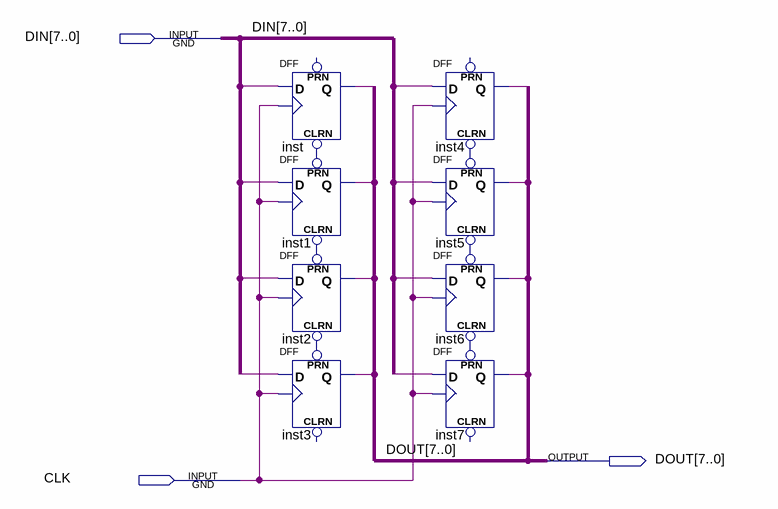
[diagram p0: schematic sheet]
// Quartus schematic reg8d.bdf as structural Verilog: 8 symbols, 3 pins
module reg8d (
  input  [7:0] DIN,
  input  CLK,
  output [7:0] DOUT
);

  wire undriven, undriven_2, undriven_3, undriven_4, undriven_5, undriven_6;

  DFF inst (.CLRN(undriven), .CLK(CLK), .D(DIN[0]), .Q(DOUT[0]));  // open: PRN
  DFF inst1 (.CLRN(undriven_2), .CLK(CLK), .D(DIN[1]), .PRN(undriven), .Q(DOUT[1]));
  DFF inst2 (.CLRN(undriven_3), .CLK(CLK), .D(DIN[2]), .PRN(undriven_2), .Q(DOUT[2]));
  DFF inst3 (.CLK(CLK), .D(DIN[3]), .PRN(undriven_3), .Q(DOUT[3]));  // open: CLRN
  DFF inst4 (.CLRN(undriven_4), .CLK(CLK), .D(DIN[4]), .Q(DOUT[4]));  // open: PRN
  DFF inst5 (.CLRN(undriven_5), .CLK(CLK), .D(DIN[5]), .PRN(undriven_4), .Q(DOUT[5]));
  DFF inst6 (.CLRN(undriven_6), .CLK(CLK), .D(DIN[6]), .PRN(undriven_5), .Q(DOUT[6]));
  DFF inst7 (.CLK(CLK), .D(DIN[7]), .PRN(undriven_6), .Q(DOUT[7]));  // open: CLRN
endmodule
